# Altium project 搅拌杯.PrjPcb
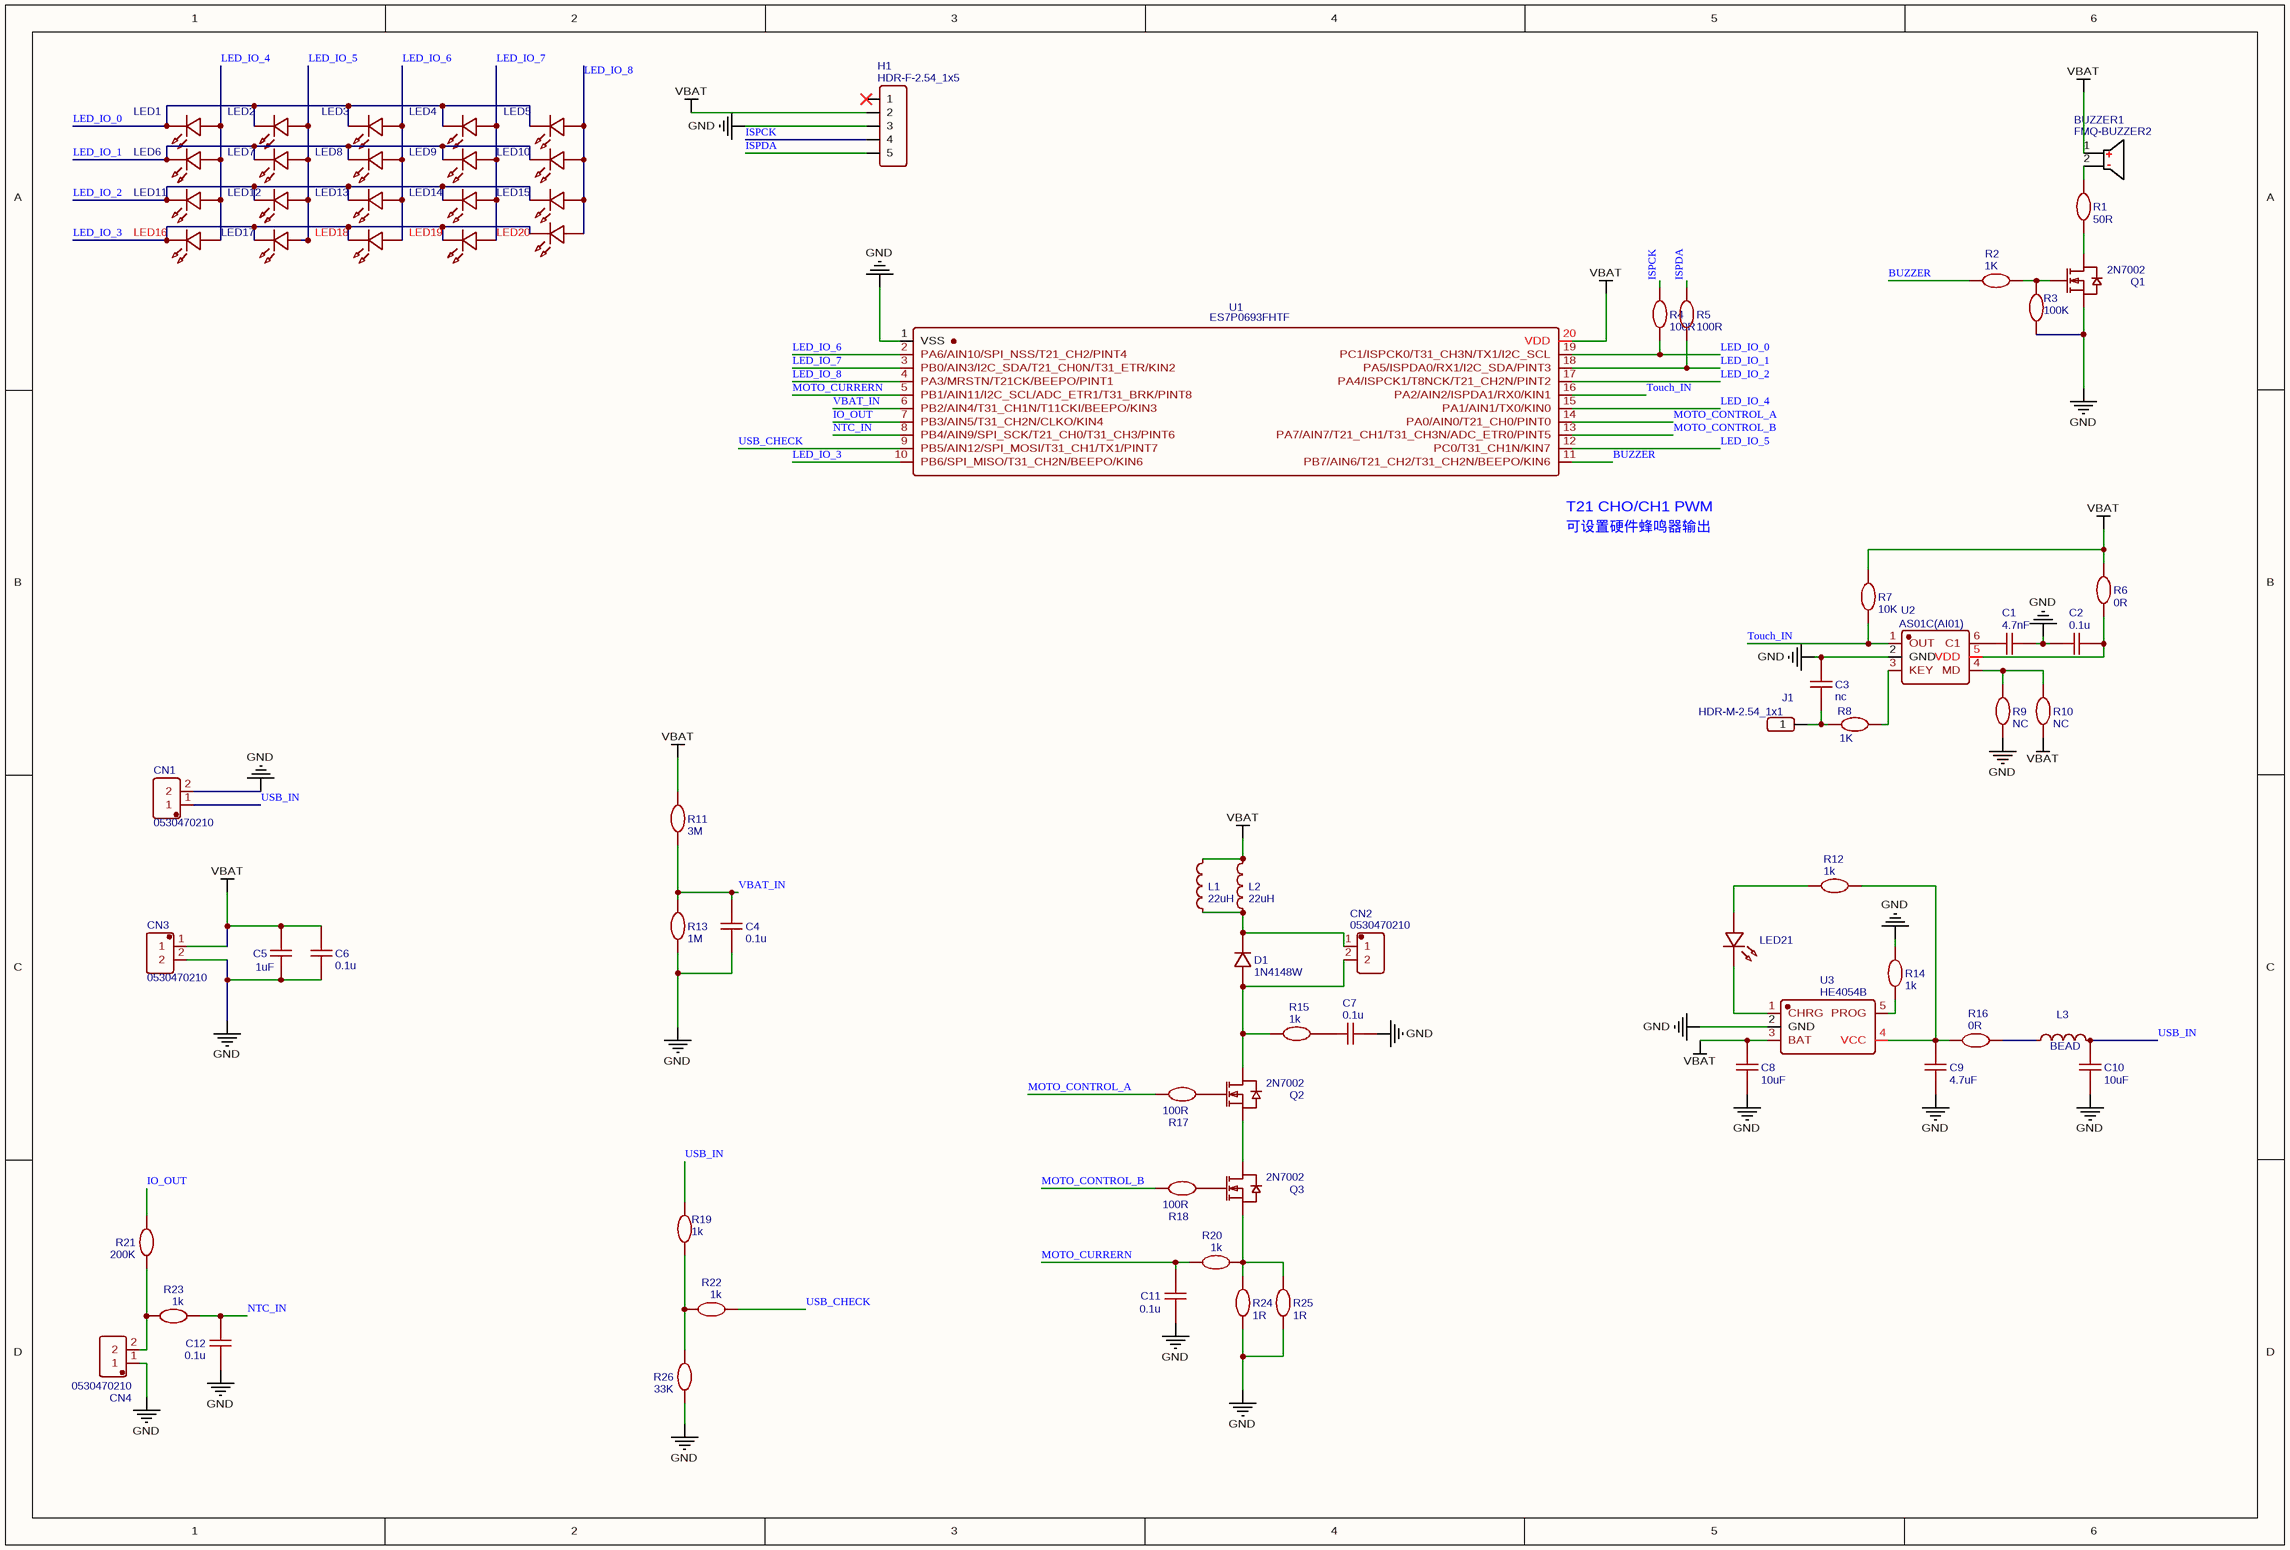
[diagram p0: 搅拌杯原理图.schdoc]
1 sheet, 76 parts. Net scope: global (net labels, ports and power ports of the same name join across sheets).
Board file: 搅拌杯PCB.PcbDoc

## Sheet 搅拌杯原理图.schdoc
size 430 x 290 mm

### Parts
BUZZER1  FMQ-BUZZER2  [BUZ-TH_BD12.0-P7.60-D0.6-FD]
C1  4.7nF  [C0603]
C2  0.1u  [C0603]
C3  nc  [C0603]
C4  0.1u  [C0603]
C5  1uF  [C0603]
C6  0.1u  [C0603]
C7  0.1u  [C0603]
C8  10uF  [C0603]
C9  4.7uF  [C0603]
C10  10uF  [C0603]
C11  0.1u  [C0603]
C12  0.1u  [C0603]
CN1  0530470210  [CONN-TH_0530470210]
CN2  0530470210  [CONN-TH_0530470210]
CN3  0530470210  [CONN-TH_0530470210]
CN4  0530470210  [CONN-TH_0530470210]
D1  1N4148W  [SOD-123FL_L2.6-W1.6-LS3.4-RD]
H1  HDR-F-2.54_1x5  [1.27mm_5PIN]
J1  HDR-M-2.54_1x1  [HDR-M-2.54_1X1]
L1  22uH  [L0603]
L2  22uH  [L0603]
L3  BEAD  [L0603]
LED1  LED-0603_W  [LED0603-FD_WHITE]  (value not drawn)
LED2  LED-0603_W  [LED0603-FD_WHITE]  (value not drawn)
LED3  LED-0603_W  [LED0603-FD_WHITE]  (value not drawn)
LED4  LED-0603_W  [LED0603-FD_WHITE]  (value not drawn)
LED5  LED-0603_W  [LED0603-FD_WHITE]  (value not drawn)
LED6  LED-0603_W  [LED0603-FD_WHITE]  (value not drawn)
LED7  LED-0603_W  [LED0603-FD_WHITE]  (value not drawn)
LED8  LED-0603_W  [LED0603-FD_WHITE]  (value not drawn)
LED9  LED-0603_W  [LED0603-FD_WHITE]  (value not drawn)
LED10  LED-0603_W  [LED0603-FD_WHITE]  (value not drawn)
LED11  LED-0603_W  [LED0603-FD_WHITE]  (value not drawn)
LED12  LED-0603_W  [LED0603-FD_WHITE]  (value not drawn)
LED13  LED-0603_W  [LED0603-FD_WHITE]  (value not drawn)
LED14  LED-0603_W  [LED0603-FD_WHITE]  (value not drawn)
LED15  LED-0603_W  [LED0603-FD_WHITE]  (value not drawn)
LED16  LED-0603_W  [LED0603-FD_WHITE]  (value not drawn)
LED17  LED-0603_W  [LED0603-FD_WHITE]  (value not drawn)
LED18  LED-0603_W  [LED0603-FD_WHITE]  (value not drawn)
LED19  LED-0603_W  [LED0603-FD_WHITE]  (value not drawn)
LED20  LED-0603_W  [LED0603-FD_WHITE]  (value not drawn)
LED21  LED-0603_W  [LED0603-FD_WHITE]  (value not drawn)
Q1  2N7002  [SOT-23_L2.9-W1.3-P0.95-LS2.4-BR]
Q2  2N7002  [SOT-23_L2.9-W1.3-P0.95-LS2.4-BR]
Q3  2N7002  [SOT-23_L2.9-W1.3-P0.95-LS2.4-BR]
R1  50R  [R0603]
R2  1K  [R0603]
R3  100K  [R0603]
R4  100R  [R0603]
R5  100R  [R0603]
R6  0R  [R0603]
R7  10K  [R0603]
R8  1K  [R0603]
R9  NC  [R0603]
R10  NC  [R0603]
R11  3M  [R0603]
R12  1k  [R0603]
R13  1M  [R0603]
R14  1k  [R0603]
R15  1k  [R0603]
R16  0R  [R0603]
R17  100R  [R0603]
R18  100R  [R0603]
R19  1k  [R0603]
R20  1k  [R0603]
R21  200K  [R0603]
R22  1k  [R0603]
R23  1k  [R0603]
R24  1R  [R1206]
R25  1R  [R1206]
R26  33K  [R0603]
U1  ES7P0693FHTF  [TSOP20]  (value not drawn)
U2  AS01C(AI01)  [SOT-23-6_L2.9-W1.6-P0.95-LS2.8-BL]
U3  HE4054B  [SOT-23-5_L3.0-W1.7-P0.95-LS2.8-BR]

### Nets
GND: C1.2 C2.1 C3.2 C4.1 C5.2 C6.2 C7.1 C8.1 C9.1 C10.1 C11.1 C12.2 CN1.2 CN3.2 CN4.1 H1.3 Q1.2(S) R3.2 R9.1 R13.1 R14.2 R24.1 R25.1 R26.2 U1.1(VSS) U2.2(GND) U3.2(GND)
VBAT: BUZZER1.1 C5.1 C6.1 C8.2 CN3.1 H1.2 L1.2 L2.2 R6.2 R7.2 R10.1 R11.2 U1.20(VDD) U3.3(BAT)
BUZZER: R2.2 U1.11(PB7/AIN6/T21_CH2/T31_CH2N/BEEPO/KIN6)
IO_OUT: R21.1 U1.7(PB3/AIN5/T31_CH2N/CLKO/KIN4)
ISPCK: H1.4 R4.1
ISPDA: H1.5 R5.1
LED_IO_0: LED1.2 LED2.2 LED3.2 LED4.2 LED5.2 R4.2 U1.19(PC1/ISPCK0/T31_CH3N/TX1/I2C_SCL)
LED_IO_1: LED6.2 LED7.2 LED8.2 LED9.2 LED10.2 R5.2 U1.18(PA5/ISPDA0/RX1/I2C_SDA/PINT3)
LED_IO_2: LED11.2 LED12.2 LED13.2 LED14.2 LED15.2 U1.17(PA4/ISPCK1/T8NCK/T21_CH2N/PINT2)
LED_IO_3: LED16.2 LED17.2 LED18.2 LED19.2 LED20.2 U1.10(PB6/SPI_MISO/T31_CH2N/BEEPO/KIN6)
LED_IO_4: LED1.1 LED6.1 LED11.1 LED16.1 U1.15(PA1/AIN1/TX0/KIN0)
LED_IO_5: LED2.1 LED7.1 LED12.1 LED17.1 U1.12(PC0/T31_CH1N/KIN7)
LED_IO_6: LED3.1 LED8.1 LED13.1 LED18.1 U1.2(PA6/AIN10/SPI_NSS/T21_CH2/PINT4)
LED_IO_7: LED4.1 LED9.1 LED14.1 LED19.1 U1.3(PB0/AIN3/I2C_SDA/T21_CH0N/T31_ETR/KIN2)
LED_IO_8: LED5.1 LED10.1 LED15.1 LED20.1 U1.4(PA3/MRSTN/T21CK/BEEPO/PINT1)
MOTO_CONTROL_A: R17.1 U1.14(PA0/AIN0/T21_CH0/PINT0)
MOTO_CONTROL_B: R18.1 U1.13(PA7/AIN7/T21_CH1/T31_CH3N/ADC_ETR0/PINT5)
MOTO_CURRERN: C11.2 R20.2 U1.5(PB1/AIN11/I2C_SCL/ADC_ETR1/T31_BRK/PINT8)
NTC_IN: C12.1 R23.2 U1.8(PB4/AIN9/SPI_SCK/T21_CH0/T31_CH3/PINT6)
Touch_IN: R7.1 U1.16(PA2/AIN2/ISPDA1/RX0/KIN1) U2.1(OUT)
USB_CHECK: R22.2 U1.9(PB5/AIN12/SPI_MOSI/T31_CH1/TX1/PINT7)
USB_IN: C10.2 CN1.1 L3.2 R19.2
VBAT_IN: C4.2 R11.1 R13.2 U1.6(PB2/AIN4/T31_CH1N/T11CKI/BEEPO/KIN3)
NetBUZZER1_2: BUZZER1.2 R1.1
NetC1_1: C1.1 U2.6(C1)
NetC2_2: C2.2 R6.1 U2.5(VDD)
NetC3_1: C3.1 J1.1 R8.2
NetC7_2: C7.2 R15.1
NetC9_2: C9.2 R12.1 R16.1 U3.4(VCC)
NetCN2_1: CN2.1 D1.1 L1.1 L2.1
NetCN2_2: CN2.2 D1.2 Q2.3(D) R15.2
NetCN4_2: CN4.2 R21.2 R23.1
NetL3_1: L3.1 R16.2
NetLED21_1: LED21.1 R12.2
NetLED21_2: LED21.2 U3.1(CHRG)
NetQ1_1: Q1.1(G) R2.1 R3.1
NetQ1_3: Q1.3(D) R1.2
NetQ2_1: Q2.1(G) R17.2
NetQ2_2: Q2.2(S) Q3.3(D)
NetQ3_1: Q3.1(G) R18.2
NetQ3_2: Q3.2(S) R20.1 R24.2 R25.2
NetR8_1: R8.1 U2.3(KEY)
NetR9_2: R9.2 R10.2 U2.4(MD)
NetR14_1: R14.1 U3.5(PROG)
NetR19_1: R19.1 R22.1 R26.1

Not connected (* = marked no-connect by the designer): H1 1*

### Notes on the sheet
- 可设置硬件蜂鸣器输出
- (near U1) T21 CHO/CH1 PWM

### Library data of the parts
BUZZER1 = FMQ-BUZZER2: Contributor: LCSC; BOM_Supplier: LCSC; BOM_Supplier Part: C9900006103; BOM_Manufacturer Part: FMQ-BUZZER2; BOM_JLCPCB Part Class: Extended Part; spicePre: B; spiceSymbolName: FMQ-BUZZER2
C1 = 4.7nF: nameAlias: Value(F); Contributor: LCEDA_Lib; spicePre: C; spiceSymbolName: C_0805_US
C2 C4 C6 C7 C11 C12 = 0.1u: nameAlias: Value(F); Contributor: LCEDA_Lib; spicePre: C
  C2: spiceSymbolName: C_0805_US
  C4 C6 C7 C11 C12: spiceSymbolName: C_0603_US
C3 = nc: nameAlias: Value(F); Contributor: LCEDA_Lib; spicePre: C; spiceSymbolName: C_0805_US
C5 = 1uF: nameAlias: Value(F); Contributor: LCEDA_Lib; spicePre: C; spiceSymbolName: C_0603_US
C8 C10 = 10uF: nameAlias: Value(F); Contributor: LCEDA_Lib; spicePre: C; spiceSymbolName: C_0805_US
C9 = 4.7uF: nameAlias: Value(F); Contributor: LCEDA_Lib; spicePre: C; spiceSymbolName: C_0805_US
CN1-CN4 = 0530470210: BOM_Manufacturer: MOLEX; Contributor: LCSC; BOM_Supplier: LCSC; BOM_Manufacturer Part: 0530470210; BOM_Supplier Part: C114130; BOM_JLCPCB Part Class: Extended Part; spicePre: C; spiceSymbolName: 0530470210
D1 = 1N4148W: BOM_Manufacturer: Tak Cheong; Contributor: LCEDA_Lib; BOM_Supplier: LCSC; BOM_Manufacturer Part: 1N4148W; BOM_Supplier Part: C129216; spicePre: D; spiceSymbolName: 1N4148W
H1 = HDR-F-2.54_1x5: Contributor: LCEDA_Lib; BOM_Supplier Part: C50950; BOM_Supplier: LCSC; spicePre: H; spiceSymbolName: HDR-F-2.54_1x5
J1 = HDR-M-2.54_1x1: Contributor: LCEDA_Lib; BOM_Supplier Part: C81276; BOM_Supplier: LCSC; spicePre: J; spiceSymbolName: HDR-M-2.54_1x1
L1-L3 = 22uH: nameAlias: Value(H); Contributor: LCEDA_Lib; spicePre: L; spiceSymbolName: L0603_US
LED1-LED21 = LED-0603_W: BOM_Manufacturer: EVERLIGHT(台湾亿光); BOM_Manufacturer Part: 17-21SURC/S530-A3/TR8; Contributor: LCEDA_Lib; BOM_Supplier Part: C72037; spicePre: L; spiceSymbolName: LED-0805_R
Q1-Q3 = 2N7002: BOM_Manufacturer: Nexperia; BOM_Manufacturer Part: 2N7002,215; BOM_Paste Type: expand; Contributor: LCEDA_Lib; BOM_Supplier: LCSC; image: //image.lceda.cn/szlcsc/C65189.jpg; BOM_Supplier Part: C65189; spicePre: Q; spiceSymbolName: 2N7002
R1 R4 R5 R17 R18 = 100R: nameAlias: Value(Ω); Contributor: LCEDA_Lib; spicePre: R; spiceSymbolName: R_0603_EU
R2 R3 R8 = 1K: nameAlias: Value(Ω); Contributor: LCEDA_Lib; spicePre: R; spiceSymbolName: R_0603_EU
R6 R7 R9 R10 R16 = NC: nameAlias: Value(Ω); Contributor: LCEDA_Lib; spicePre: R; spiceSymbolName: R_0603_EU
R11 = 430k: nameAlias: Value(Ω); Contributor: LCEDA_Lib; spicePre: R; spiceSymbolName: R_0603_EU
R12 R14 R15 R19 R20 R22 R23 = 1k: nameAlias: Value(Ω); Contributor: LCEDA_Lib; spicePre: R; spiceSymbolName: R_0603_EU
R13 = 430K: nameAlias: Value(Ω); Contributor: LCEDA_Lib; spicePre: R; spiceSymbolName: R_0603_EU
R21 R26 = 33K: nameAlias: Value(Ω); Contributor: LCEDA_Lib; spicePre: R; spiceSymbolName: R_0603_EU
R24 R25 = 1R: nameAlias: Value(Ω); Contributor: LCEDA_Lib; spicePre: R; spiceSymbolName: R_0603_EU
U1 = ES7P0693FHTF: Contributor: zime_zl; spicePre: U; spiceSymbolName: ES7P0693FHTF
U2 = AS01C(AI01): BOM_Manufacturer: Sam&wing; Contributor: LCSC; BOM_Supplier: LCSC; BOM_Supplier Part: C389617; BOM_Manufacturer Part: AS01C(AI01); BOM_JLCPCB Part Class: Extended Part; spicePre: U; spiceSymbolName: AS01C(AI01)
U3 = HE4054B: BOM_Manufacturer: HEERMICR; Contributor: LCSC; BOM_Supplier: LCSC; BOM_Supplier Part: C711953; BOM_Manufacturer Part: HE4054B; BOM_JLCPCB Part Class: Extended Part; spicePre: U; spiceSymbolName: HE4054B